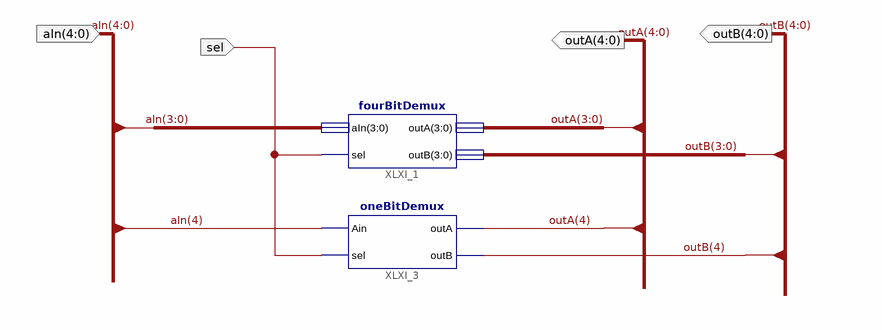
[diagram p0: schematic sheet 1]
// Xilinx ISE schematic fiveBitDemux.sch (spartan3e) as structural Verilog: 2 symbols, 4 ports
module fiveBitDemux (
  input  [4:0] aIn,
  input  sel,
  output [4:0] outA,
  output [4:0] outB
);

  fourBitDemux XLXI_1 (.aIn(aIn[3:0]), .sel(sel), .outA(outA[3:0]), .outB(outB[3:0]));
  oneBitDemux XLXI_3 (.Ain(aIn[4]), .sel(sel), .outA(outA[4]), .outB(outB[4]));
endmodule
